# Altium project SVPXGR740_3U.PrjPcb (part 3 of 8)

## Sheet GR740_Memory.SchDoc
size A3
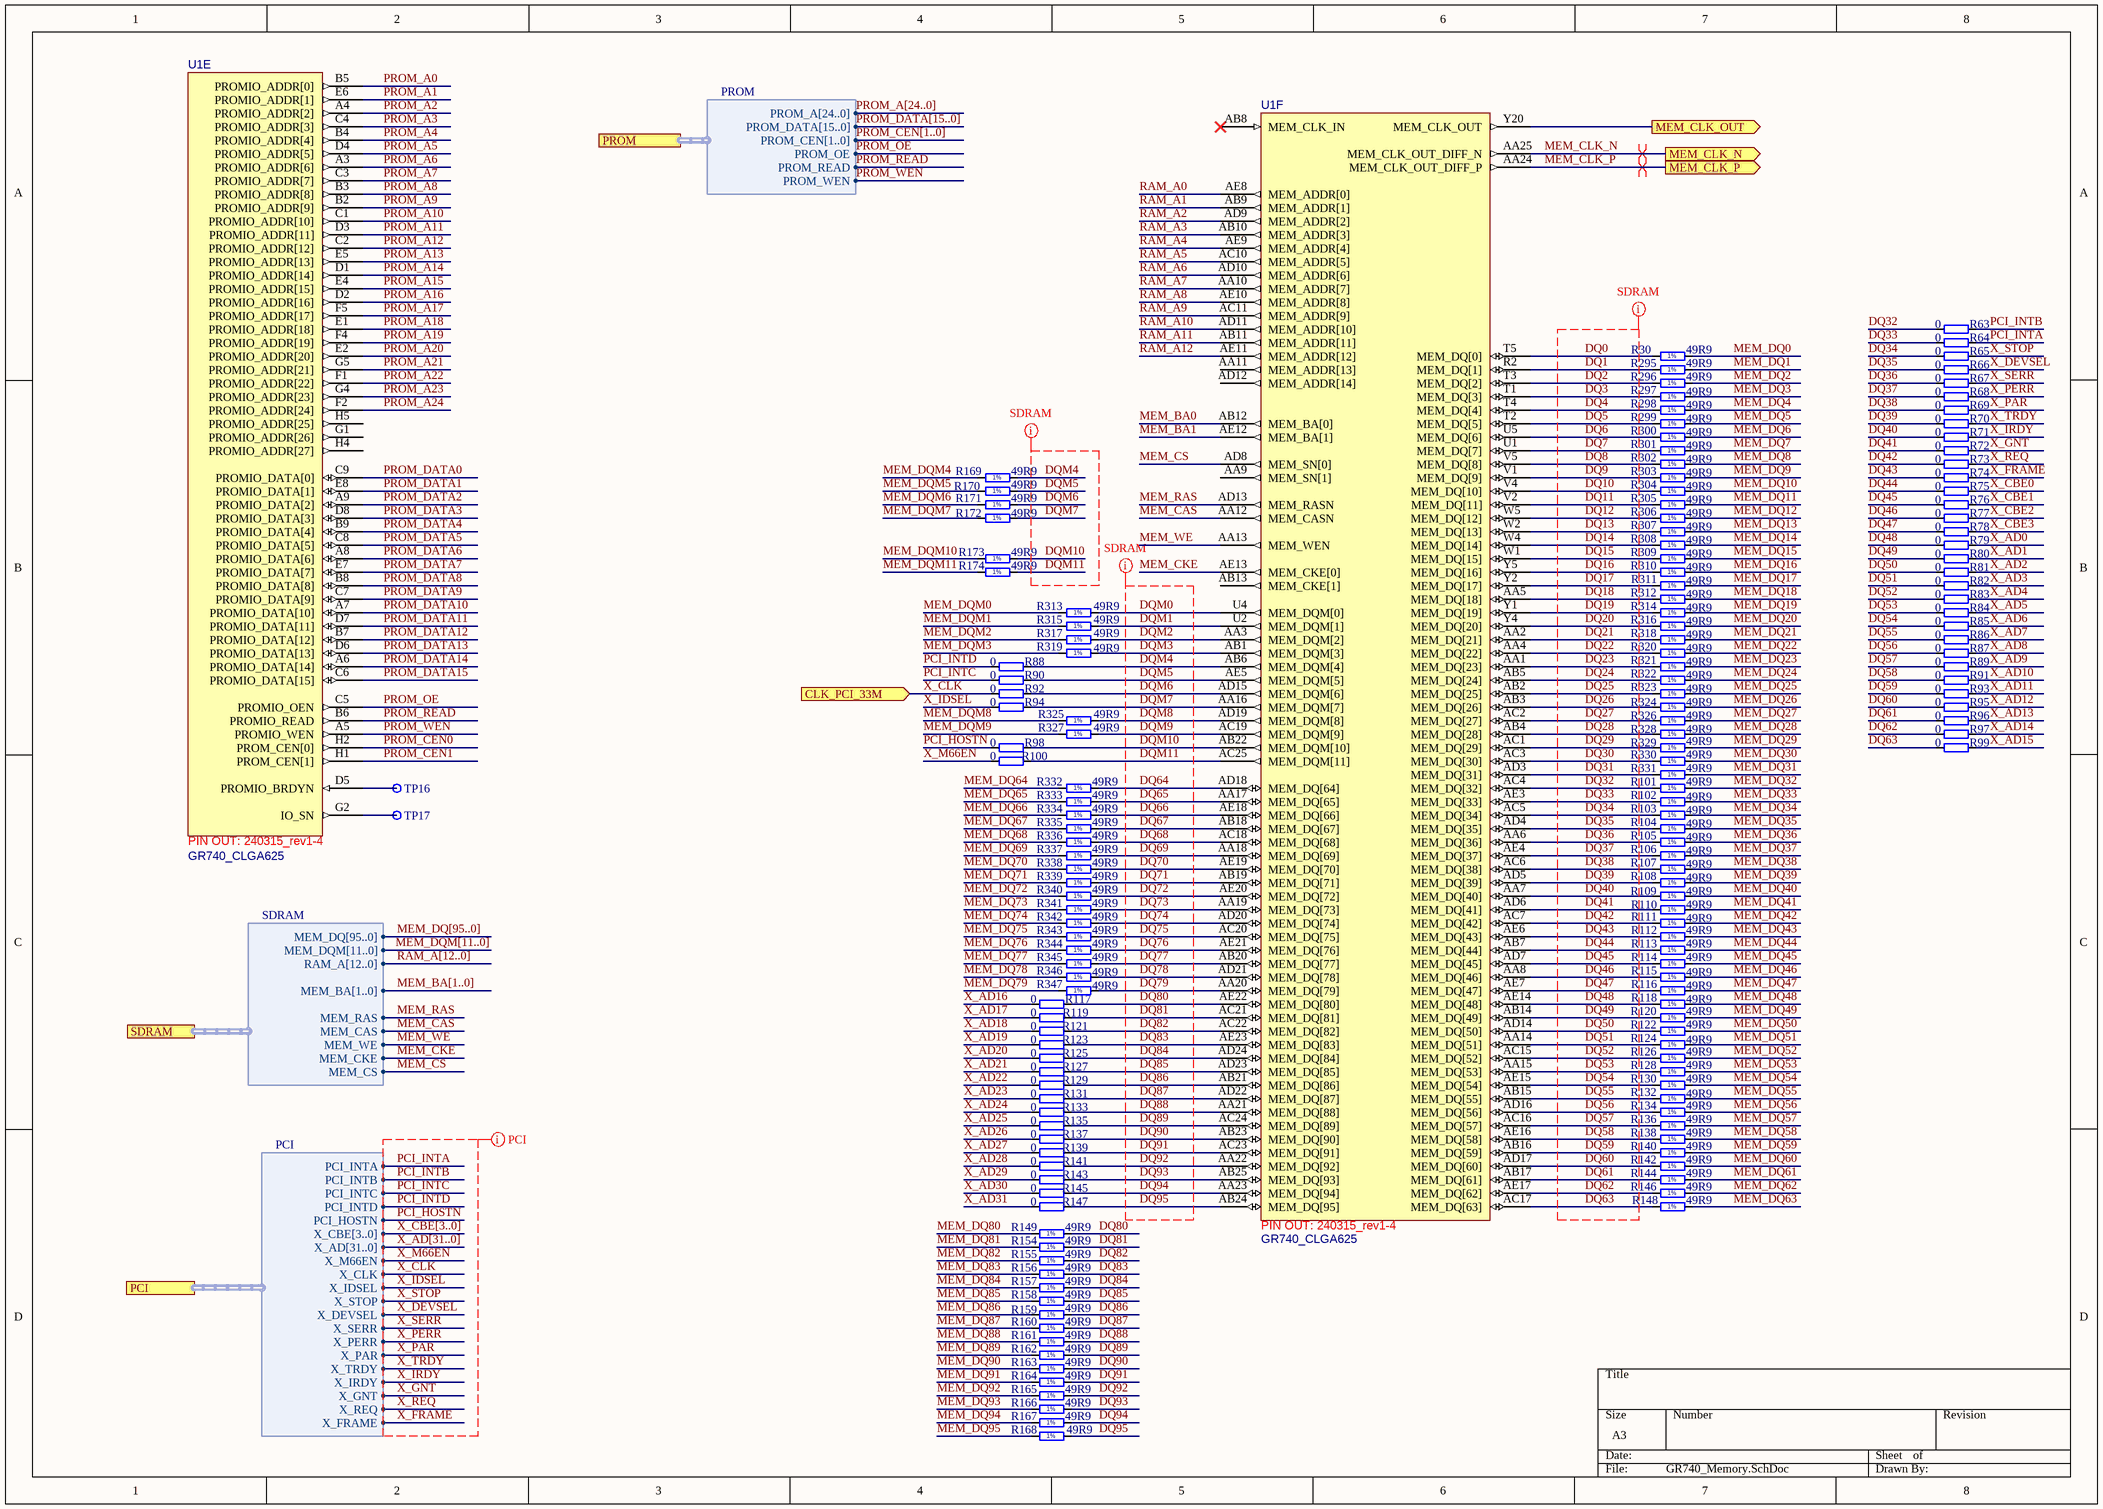
[diagram p8: GR740_Memory.SchDoc]

### Parts
R30  49R9  [RESC0603X28N]
R63  0  [RESC0603X28N]
R64  0  [RESC0603X28N]
R65  0  [RESC0603X28N]
R66  0  [RESC0603X28N]
R67  0  [RESC0603X28N]
R68  0  [RESC0603X28N]
R69  0  [RESC0603X28N]
R70  0  [RESC0603X28N]
R71  0  [RESC0603X28N]
R72  0  [RESC0603X28N]
R73  0  [RESC0603X28N]
R74  0  [RESC0603X28N]
R75  0  [RESC0603X28N]
R76  0  [RESC0603X28N]
R77  0  [RESC0603X28N]
R78  0  [RESC0603X28N]
R79  0  [RESC0603X28N]
R80  0  [RESC0603X28N]
R81  0  [RESC0603X28N]
R82  0  [RESC0603X28N]
R83  0  [RESC0603X28N]
R84  0  [RESC0603X28N]
R85  0  [RESC0603X28N]
R86  0  [RESC0603X28N]
R87  0  [RESC0603X28N]
R88  0  [RESC0603X28N]
R89  0  [RESC0603X28N]
R90  0  [RESC0603X28N]
R91  0  [RESC0603X28N]
R92  0  [RESC0603X28N]
R93  0  [RESC0603X28N]
R94  0  [RESC0603X28N]
R95  0  [RESC0603X28N]
R96  0  [RESC0603X28N]
R97  0  [RESC0603X28N]
R98  0  [RESC0603X28N]
R99  0  [RESC0603X28N]
R100  0  [RESC0603X28N]
R101  49R9  [RESC0603X28N]
R102  49R9  [RESC0603X28N]
R103  49R9  [RESC0603X28N]
R104  49R9  [RESC0603X28N]
R105  49R9  [RESC0603X28N]
R106  49R9  [RESC0603X28N]
R107  49R9  [RESC0603X28N]
R108  49R9  [RESC0603X28N]
R109  49R9  [RESC0603X28N]
R110  49R9  [RESC0603X28N]
R111  49R9  [RESC0603X28N]
R112  49R9  [RESC0603X28N]
R113  49R9  [RESC0603X28N]
R114  49R9  [RESC0603X28N]
R115  49R9  [RESC0603X28N]
R116  49R9  [RESC0603X28N]
R117  0  [RESC0603X28N]
R118  49R9  [RESC0603X28N]
R119  0  [RESC0603X28N]
R120  49R9  [RESC0603X28N]
R121  0  [RESC0603X28N]
R122  49R9  [RESC0603X28N]
R123  0  [RESC0603X28N]
R124  49R9  [RESC0603X28N]
R125  0  [RESC0603X28N]
R126  49R9  [RESC0603X28N]
R127  0  [RESC0603X28N]
R128  49R9  [RESC0603X28N]
R129  0  [RESC0603X28N]
R130  49R9  [RESC0603X28N]
R131  0  [RESC0603X28N]
R132  49R9  [RESC0603X28N]
R133  0  [RESC0603X28N]
R134  49R9  [RESC0603X28N]
R135  0  [RESC0603X28N]
R136  49R9  [RESC0603X28N]
R137  0  [RESC0603X28N]
R138  49R9  [RESC0603X28N]
R139  0  [RESC0603X28N]
R140  49R9  [RESC0603X28N]
R141  0  [RESC0603X28N]
R142  49R9  [RESC0603X28N]
R143  0  [RESC0603X28N]
R144  49R9  [RESC0603X28N]
R145  0  [RESC0603X28N]
R146  49R9  [RESC0603X28N]
R147  0  [RESC0603X28N]
R148  49R9  [RESC0603X28N]
R149  49R9  [RESC0603X28N]
R154  49R9  [RESC0603X28N]
R155  49R9  [RESC0603X28N]
R156  49R9  [RESC0603X28N]
R157  49R9  [RESC0603X28N]
R158  49R9  [RESC0603X28N]
R159  49R9  [RESC0603X28N]
R160  49R9  [RESC0603X28N]
R161  49R9  [RESC0603X28N]
R162  49R9  [RESC0603X28N]
R163  49R9  [RESC0603X28N]
R164  49R9  [RESC0603X28N]
R165  49R9  [RESC0603X28N]
R166  49R9  [RESC0603X28N]
R167  49R9  [RESC0603X28N]
R168  49R9  [RESC0603X28N]
R169  49R9  [RESC0603X28N]
R170  49R9  [RESC0603X28N]
R171  49R9  [RESC0603X28N]
R172  49R9  [RESC0603X28N]
R173  49R9  [RESC0603X28N]
R174  49R9  [RESC0603X28N]
R295  49R9  [RESC0603X28N]
R296  49R9  [RESC0603X28N]
R297  49R9  [RESC0603X28N]
R298  49R9  [RESC0603X28N]
R299  49R9  [RESC0603X28N]
R300  49R9  [RESC0603X28N]
R301  49R9  [RESC0603X28N]
R302  49R9  [RESC0603X28N]
R303  49R9  [RESC0603X28N]
R304  49R9  [RESC0603X28N]
R305  49R9  [RESC0603X28N]
R306  49R9  [RESC0603X28N]
R307  49R9  [RESC0603X28N]
R308  49R9  [RESC0603X28N]
R309  49R9  [RESC0603X28N]
R310  49R9  [RESC0603X28N]
R311  49R9  [RESC0603X28N]
R312  49R9  [RESC0603X28N]
R313  49R9  [RESC0603X28N]
R314  49R9  [RESC0603X28N]
R315  49R9  [RESC0603X28N]
R316  49R9  [RESC0603X28N]
R317  49R9  [RESC0603X28N]
R318  49R9  [RESC0603X28N]
R319  49R9  [RESC0603X28N]
R320  49R9  [RESC0603X28N]
R321  49R9  [RESC0603X28N]
R322  49R9  [RESC0603X28N]
R323  49R9  [RESC0603X28N]
R324  49R9  [RESC0603X28N]
R325  49R9  [RESC0603X28N]
R326  49R9  [RESC0603X28N]
R327  49R9  [RESC0603X28N]
R328  49R9  [RESC0603X28N]
R329  49R9  [RESC0603X28N]
R330  49R9  [RESC0603X28N]
R331  49R9  [RESC0603X28N]
R332  49R9  [RESC0603X28N]
R333  49R9  [RESC0603X28N]
R334  49R9  [RESC0603X28N]
R335  49R9  [RESC0603X28N]
R336  49R9  [RESC0603X28N]
R337  49R9  [RESC0603X28N]
R338  49R9  [RESC0603X28N]
R339  49R9  [RESC0603X28N]
R340  49R9  [RESC0603X28N]
R341  49R9  [RESC0603X28N]
R342  49R9  [RESC0603X28N]
R343  49R9  [RESC0603X28N]
R344  49R9  [RESC0603X28N]
R345  49R9  [RESC0603X28N]
R346  49R9  [RESC0603X28N]
R347  49R9  [RESC0603X28N]
TP16  Test Point  [TPS127]  (value not drawn)
TP17  Test Point  [TPS127]  (value not drawn)
U1  GR740_CLGA625  [BGA625C100P25X25_3182X3182X1543]  (parts E,F of 10)

### Ports
CLK_PCI_33M (in), MEM_CLK_N (out), MEM_CLK_OUT (out), MEM_CLK_P (out), PCI (harness PCI), PROM (harness PROM), SDRAM (harness SDRAM)

### Harnesses
SDRAM: MEM_DQ[95..0], MEM_DQM[11..0], RAM_A[12..0], MEM_BA[1..0], MEM_RAS, MEM_CAS, MEM_WE, MEM_CKE, MEM_CS
PCI: PCI_INTA, PCI_INTB, PCI_INTC, PCI_INTD, PCI_HOSTN, X_CBE[3..0], X_AD[31..0], X_M66EN, X_CLK, X_IDSEL, X_STOP, X_DEVSEL, X_SERR, X_PERR, X_PAR, X_TRDY, X_IRDY, X_GNT, X_REQ, X_FRAME
PROM: PROM_A[24..0], PROM_DATA[15..0], PROM_CEN[1..0], PROM_OE, PROM_READ, PROM_WEN

### Nets
DQ0: R30.1 U1.T5(MEM_DQ[0])
DQ1: R295.1 U1.R2(MEM_DQ[1])
DQ2: R296.1 U1.T3(MEM_DQ[2])
DQ3: R297.1 U1.T1(MEM_DQ[3])
DQ4: R298.1 U1.T4(MEM_DQ[4])
DQ5: R299.1 U1.T2(MEM_DQ[5])
DQ6: R300.1 U1.U5(MEM_DQ[6])
DQ7: R301.1 U1.U1(MEM_DQ[7])
DQ8: R302.1 U1.V5(MEM_DQ[8])
DQ9: R303.1 U1.V1(MEM_DQ[9])
DQ10: R304.1 U1.V4(MEM_DQ[10])
DQ11: R305.1 U1.V2(MEM_DQ[11])
DQ12: R306.1 U1.W5(MEM_DQ[12])
DQ13: R307.1 U1.W2(MEM_DQ[13])
DQ14: R308.1 U1.W4(MEM_DQ[14])
DQ15: R309.1 U1.W1(MEM_DQ[15])
DQ16: R310.1 U1.Y5(MEM_DQ[16])
DQ17: R311.1 U1.Y2(MEM_DQ[17])
DQ18: R312.1 U1.AA5(MEM_DQ[18])
DQ19: R314.1 U1.Y1(MEM_DQ[19])
DQ20: R316.1 U1.Y4(MEM_DQ[20])
DQ21: R318.1 U1.AA2(MEM_DQ[21])
DQ22: R320.1 U1.AA4(MEM_DQ[22])
DQ23: R321.1 U1.AA1(MEM_DQ[23])
DQ24: R322.1 U1.AB5(MEM_DQ[24])
DQ25: R323.1 U1.AB2(MEM_DQ[25])
DQ26: R324.1 U1.AB3(MEM_DQ[26])
DQ27: R326.1 U1.AC2(MEM_DQ[27])
DQ28: R328.1 U1.AB4(MEM_DQ[28])
DQ29: R329.1 U1.AC1(MEM_DQ[29])
DQ30: R330.1 U1.AC3(MEM_DQ[30])
DQ31: R331.1 U1.AD3(MEM_DQ[31])
DQ32: R63.1 R101.1 U1.AC4(MEM_DQ[32])
DQ33: R64.1 R102.1 U1.AE3(MEM_DQ[33])
DQ34: R65.1 R103.1 U1.AC5(MEM_DQ[34])
DQ35: R66.1 R104.1 U1.AD4(MEM_DQ[35])
DQ36: R67.1 R105.1 U1.AA6(MEM_DQ[36])
DQ37: R68.1 R106.1 U1.AE4(MEM_DQ[37])
DQ38: R69.1 R107.1 U1.AC6(MEM_DQ[38])
DQ39: R70.1 R108.1 U1.AD5(MEM_DQ[39])
DQ40: R71.1 R109.1 U1.AA7(MEM_DQ[40])
DQ41: R72.1 R110.1 U1.AD6(MEM_DQ[41])
DQ42: R73.1 R111.1 U1.AC7(MEM_DQ[42])
DQ43: R74.1 R112.1 U1.AE6(MEM_DQ[43])
DQ44: R75.1 R113.1 U1.AB7(MEM_DQ[44])
DQ45: R76.1 R114.1 U1.AD7(MEM_DQ[45])
DQ46: R77.1 R115.1 U1.AA8(MEM_DQ[46])
DQ47: R78.1 R116.1 U1.AE7(MEM_DQ[47])
DQ48: R79.1 R118.1 U1.AE14(MEM_DQ[48])
DQ49: R80.1 R120.1 U1.AB14(MEM_DQ[49])
DQ50: R81.1 R122.1 U1.AD14(MEM_DQ[50])
DQ51: R82.1 R124.1 U1.AA14(MEM_DQ[51])
DQ52: R83.1 R126.1 U1.AC15(MEM_DQ[52])
DQ53: R84.1 R128.1 U1.AA15(MEM_DQ[53])
DQ54: R85.1 R130.1 U1.AE15(MEM_DQ[54])
DQ55: R86.1 R132.1 U1.AB15(MEM_DQ[55])
DQ56: R87.1 R134.1 U1.AD16(MEM_DQ[56])
DQ57: R89.1 R136.1 U1.AC16(MEM_DQ[57])
DQ58: R91.1 R138.1 U1.AE16(MEM_DQ[58])
DQ59: R93.1 R140.1 U1.AB16(MEM_DQ[59])
DQ60: R95.1 R142.1 U1.AD17(MEM_DQ[60])
DQ61: R96.1 R144.1 U1.AB17(MEM_DQ[61])
DQ62: R97.1 R146.1 U1.AE17(MEM_DQ[62])
DQ63: R99.1 R148.1 U1.AC17(MEM_DQ[63])
DQ64: R332.2 U1.AD18(MEM_DQ[64])
DQ65: R333.2 U1.AA17(MEM_DQ[65])
DQ66: R334.2 U1.AE18(MEM_DQ[66])
DQ67: R335.2 U1.AB18(MEM_DQ[67])
DQ68: R336.2 U1.AC18(MEM_DQ[68])
DQ69: R337.2 U1.AA18(MEM_DQ[69])
DQ70: R338.2 U1.AE19(MEM_DQ[70])
DQ71: R339.2 U1.AB19(MEM_DQ[71])
DQ72: R340.2 U1.AE20(MEM_DQ[72])
DQ73: R341.2 U1.AA19(MEM_DQ[73])
DQ74: R342.2 U1.AD20(MEM_DQ[74])
DQ75: R343.2 U1.AC20(MEM_DQ[75])
DQ76: R344.2 U1.AE21(MEM_DQ[76])
DQ77: R345.2 U1.AB20(MEM_DQ[77])
DQ78: R346.2 U1.AD21(MEM_DQ[78])
DQ79: R347.2 U1.AA20(MEM_DQ[79])
DQ80: R117.2 R149.2 U1.AE22(MEM_DQ[80])
DQ81: R119.2 R154.2 U1.AC21(MEM_DQ[81])
DQ82: R121.2 R155.2 U1.AC22(MEM_DQ[82])
DQ83: R123.2 R156.2 U1.AE23(MEM_DQ[83])
DQ84: R125.2 R157.2 U1.AD24(MEM_DQ[84])
DQ85: R127.2 R158.2 U1.AD23(MEM_DQ[85])
DQ86: R129.2 R159.2 U1.AB21(MEM_DQ[86])
DQ87: R131.2 R160.2 U1.AD22(MEM_DQ[87])
DQ88: R133.2 R161.2 U1.AA21(MEM_DQ[88])
DQ89: R135.2 R162.2 U1.AC24(MEM_DQ[89])
DQ90: R137.2 R163.2 U1.AB23(MEM_DQ[90])
DQ91: R139.2 R164.2 U1.AC23(MEM_DQ[91])
DQ92: R141.2 R165.2 U1.AA22(MEM_DQ[92])
DQ93: R143.2 R166.2 U1.AB25(MEM_DQ[93])
DQ94: R145.2 R167.2 U1.AA23(MEM_DQ[94])
DQ95: R147.2 R168.2 U1.AB24(MEM_DQ[95])
DQM0: R313.2 U1.U4(MEM_DQM[0])
DQM1: R315.2 U1.U2(MEM_DQM[1])
DQM2: R317.2 U1.AA3(MEM_DQM[2])
DQM3: R319.2 U1.AB1(MEM_DQM[3])
DQM4: R88.2 R169.2 U1.AB6(MEM_DQM[4])
DQM5: R90.2 R170.2 U1.AE5(MEM_DQM[5])
DQM6: R92.2 R171.2 U1.AD15(MEM_DQM[6])
DQM7: R94.2 R172.2 U1.AA16(MEM_DQM[7])
DQM8: R325.2 U1.AD19(MEM_DQM[8])
DQM9: R327.2 U1.AC19(MEM_DQM[9])
DQM10: R98.2 R173.2 U1.AB22(MEM_DQM[10])
DQM11: R100.2 R174.2 U1.AC25(MEM_DQM[11])
MEM_BA0: U1.AB12(MEM_BA[0])
MEM_BA1: U1.AE12(MEM_BA[1])
MEM_CAS: U1.AA12(MEM_CASN) ; port SDRAM.MEM_CAS
MEM_CKE: U1.AE13(MEM_CKE[0]) ; port SDRAM.MEM_CKE
MEM_CLK_N: U1.AA25(MEM_CLK_OUT_DIFF_N) ; port MEM_CLK_N
MEM_CLK_OUT: U1.Y20(MEM_CLK_OUT) ; port MEM_CLK_OUT
MEM_CLK_P: U1.AA24(MEM_CLK_OUT_DIFF_P) ; port MEM_CLK_P
MEM_CS: U1.AD8(MEM_SN[0]) ; port SDRAM.MEM_CS
MEM_DQ0: R30.2
MEM_DQ1: R295.2
MEM_DQ2: R296.2
MEM_DQ3: R297.2
MEM_DQ4: R298.2
MEM_DQ5: R299.2
MEM_DQ6: R300.2
MEM_DQ7: R301.2
MEM_DQ8: R302.2
MEM_DQ9: R303.2
MEM_DQ10: R304.2
MEM_DQ11: R305.2
MEM_DQ12: R306.2
MEM_DQ13: R307.2
MEM_DQ14: R308.2
MEM_DQ15: R309.2
MEM_DQ16: R310.2
MEM_DQ17: R311.2
MEM_DQ18: R312.2
MEM_DQ19: R314.2
MEM_DQ20: R316.2
MEM_DQ21: R318.2
MEM_DQ22: R320.2
MEM_DQ23: R321.2
MEM_DQ24: R322.2
MEM_DQ25: R323.2
MEM_DQ26: R324.2
MEM_DQ27: R326.2
MEM_DQ28: R328.2
MEM_DQ29: R329.2
MEM_DQ30: R330.2
MEM_DQ31: R331.2
MEM_DQ32: R101.2
MEM_DQ33: R102.2
MEM_DQ34: R103.2
MEM_DQ35: R104.2
MEM_DQ36: R105.2
MEM_DQ37: R106.2
MEM_DQ38: R107.2
MEM_DQ39: R108.2
MEM_DQ40: R109.2
MEM_DQ41: R110.2
MEM_DQ42: R111.2
MEM_DQ43: R112.2
MEM_DQ44: R113.2
MEM_DQ45: R114.2
MEM_DQ46: R115.2
MEM_DQ47: R116.2
MEM_DQ48: R118.2
MEM_DQ49: R120.2
MEM_DQ50: R122.2
MEM_DQ51: R124.2
MEM_DQ52: R126.2
MEM_DQ53: R128.2
MEM_DQ54: R130.2
MEM_DQ55: R132.2
MEM_DQ56: R134.2
MEM_DQ57: R136.2
MEM_DQ58: R138.2
MEM_DQ59: R140.2
MEM_DQ60: R142.2
MEM_DQ61: R144.2
MEM_DQ62: R146.2
MEM_DQ63: R148.2
MEM_DQ64: R332.1
MEM_DQ65: R333.1
MEM_DQ66: R334.1
MEM_DQ67: R335.1
MEM_DQ68: R336.1
MEM_DQ69: R337.1
MEM_DQ70: R338.1
MEM_DQ71: R339.1
MEM_DQ72: R340.1
MEM_DQ73: R341.1
MEM_DQ74: R342.1
MEM_DQ75: R343.1
MEM_DQ76: R344.1
MEM_DQ77: R345.1
MEM_DQ78: R346.1
MEM_DQ79: R347.1
MEM_DQ80: R149.1
MEM_DQ81: R154.1
MEM_DQ82: R155.1
MEM_DQ83: R156.1
MEM_DQ84: R157.1
MEM_DQ85: R158.1
MEM_DQ86: R159.1
MEM_DQ87: R160.1
MEM_DQ88: R161.1
MEM_DQ89: R162.1
MEM_DQ90: R163.1
MEM_DQ91: R164.1
MEM_DQ92: R165.1
MEM_DQ93: R166.1
MEM_DQ94: R167.1
MEM_DQ95: R168.1
MEM_DQM0: R313.1
MEM_DQM1: R315.1
MEM_DQM2: R317.1
MEM_DQM3: R319.1
MEM_DQM4: R169.1
MEM_DQM5: R170.1
MEM_DQM6: R171.1
MEM_DQM7: R172.1
MEM_DQM8: R325.1
MEM_DQM9: R327.1
MEM_DQM10: R173.1
MEM_DQM11: R174.1
MEM_RAS: U1.AD13(MEM_RASN) ; port SDRAM.MEM_RAS
MEM_WE: U1.AA13(MEM_WEN) ; port SDRAM.MEM_WE
PCI_HOSTN: R98.1 ; port PCI.PCI_HOSTN
PCI_INTA: R64.2 ; port PCI.PCI_INTA
PCI_INTB: R63.2 ; port PCI.PCI_INTB
PCI_INTC: R90.1 ; port PCI.PCI_INTC
PCI_INTD: R88.1 ; port PCI.PCI_INTD
PROM_A0: U1.B5(PROMIO_ADDR[0])
PROM_A1: U1.E6(PROMIO_ADDR[1])
PROM_A2: U1.A4(PROMIO_ADDR[2])
PROM_A3: U1.C4(PROMIO_ADDR[3])
PROM_A4: U1.B4(PROMIO_ADDR[4])
PROM_A5: U1.D4(PROMIO_ADDR[5])
PROM_A6: U1.A3(PROMIO_ADDR[6])
PROM_A7: U1.C3(PROMIO_ADDR[7])
PROM_A8: U1.B3(PROMIO_ADDR[8])
PROM_A9: U1.B2(PROMIO_ADDR[9])
PROM_A10: U1.C1(PROMIO_ADDR[10])
PROM_A11: U1.D3(PROMIO_ADDR[11])
PROM_A12: U1.C2(PROMIO_ADDR[12])
PROM_A13: U1.E5(PROMIO_ADDR[13])
PROM_A14: U1.D1(PROMIO_ADDR[14])
PROM_A15: U1.E4(PROMIO_ADDR[15])
PROM_A16: U1.D2(PROMIO_ADDR[16])
PROM_A17: U1.F5(PROMIO_ADDR[17])
PROM_A18: U1.E1(PROMIO_ADDR[18])
PROM_A19: U1.F4(PROMIO_ADDR[19])
PROM_A20: U1.E2(PROMIO_ADDR[20])
PROM_A21: U1.G5(PROMIO_ADDR[21])
PROM_A22: U1.F1(PROMIO_ADDR[22])
PROM_A23: U1.G4(PROMIO_ADDR[23])
PROM_A24: U1.F2(PROMIO_ADDR[24])
PROM_CEN0: U1.H2(PROM_CEN[0])
PROM_CEN1: U1.H1(PROM_CEN[1])
PROM_DATA0: U1.C9(PROMIO_DATA[0])
PROM_DATA1: U1.E8(PROMIO_DATA[1])
PROM_DATA2: U1.A9(PROMIO_DATA[2])
PROM_DATA3: U1.D8(PROMIO_DATA[3])
PROM_DATA4: U1.B9(PROMIO_DATA[4])
PROM_DATA5: U1.C8(PROMIO_DATA[5])
PROM_DATA6: U1.A8(PROMIO_DATA[6])
PROM_DATA7: U1.E7(PROMIO_DATA[7])
PROM_DATA8: U1.B8(PROMIO_DATA[8])
PROM_DATA9: U1.C7(PROMIO_DATA[9])
PROM_DATA10: U1.A7(PROMIO_DATA[10])
PROM_DATA11: U1.D7(PROMIO_DATA[11])
PROM_DATA12: U1.B7(PROMIO_DATA[12])
PROM_DATA13: U1.D6(PROMIO_DATA[13])
PROM_DATA14: U1.A6(PROMIO_DATA[14])
PROM_DATA15: U1.C6(PROMIO_DATA[15])
PROM_OE: U1.C5(PROMIO_OEN) ; port PROM.PROM_OE
PROM_READ: U1.B6(PROMIO_READ) ; port PROM.PROM_READ
PROM_WEN: U1.A5(PROMIO_WEN) ; port PROM.PROM_WEN
RAM_A0: U1.AE8(MEM_ADDR[0])
RAM_A1: U1.AB9(MEM_ADDR[1])
RAM_A2: U1.AD9(MEM_ADDR[2])
RAM_A3: U1.AB10(MEM_ADDR[3])
RAM_A4: U1.AE9(MEM_ADDR[4])
RAM_A5: U1.AC10(MEM_ADDR[5])
RAM_A6: U1.AD10(MEM_ADDR[6])
RAM_A7: U1.AA10(MEM_ADDR[7])
RAM_A8: U1.AE10(MEM_ADDR[8])
RAM_A9: U1.AC11(MEM_ADDR[9])
RAM_A10: U1.AD11(MEM_ADDR[10])
RAM_A11: U1.AB11(MEM_ADDR[11])
RAM_A12: U1.AE11(MEM_ADDR[12])
X_AD0: R79.2
X_AD1: R80.2
X_AD2: R81.2
X_AD3: R82.2
X_AD4: R83.2
X_AD5: R84.2
X_AD6: R85.2
X_AD7: R86.2
X_AD8: R87.2
X_AD9: R89.2
X_AD10: R91.2
X_AD11: R93.2
X_AD12: R95.2
X_AD13: R96.2
X_AD14: R97.2
X_AD15: R99.2
X_AD16: R117.1
X_AD17: R119.1
X_AD18: R121.1
X_AD19: R123.1
X_AD20: R125.1
X_AD21: R127.1
X_AD22: R129.1
X_AD23: R131.1
X_AD24: R133.1
X_AD25: R135.1
X_AD26: R137.1
X_AD27: R139.1
X_AD28: R141.1
X_AD29: R143.1
X_AD30: R145.1
X_AD31: R147.1
X_CBE0: R75.2
X_CBE1: R76.2
X_CBE2: R77.2
X_CBE3: R78.2
X_CLK: R92.1 ; port CLK_PCI_33M, port PCI.X_CLK
X_DEVSEL: R66.2 ; port PCI.X_DEVSEL
X_FRAME: R74.2 ; port PCI.X_FRAME
X_GNT: R72.2 ; port PCI.X_GNT
X_IDSEL: R94.1 ; port PCI.X_IDSEL
X_IRDY: R71.2 ; port PCI.X_IRDY
X_M66EN: R100.1 ; port PCI.X_M66EN
X_PAR: R69.2 ; port PCI.X_PAR
X_PERR: R68.2 ; port PCI.X_PERR
X_REQ: R73.2 ; port PCI.X_REQ
X_SERR: R67.2 ; port PCI.X_SERR
X_STOP: R65.2 ; port PCI.X_STOP
X_TRDY: R70.2 ; port PCI.X_TRDY
NetTP16_1: TP16.1 U1.D5(PROMIO_BRDYN)
NetTP17_1: TP17.1 U1.G2(IO_SN)

Not connected (* = marked no-connect by the designer): U1 AA9(MEM_SN[1]) AA11(MEM_ADDR[13]) AB8(MEM_CLK_IN)* AB13(MEM_CKE[1]) AD12(MEM_ADDR[14]) G1(PROMIO_ADDR[26]) H4(PROMIO_ADDR[27]) H5(PROMIO_ADDR[25])

### Buses and harness runs
bus MEM_BA[1..0]
bus MEM_DQ[95..0]
bus MEM_DQM[11..0]
bus PROM_A[24..0]
bus PROM_CEN[1..0]
bus PROM_DATA[15..0]
bus RAM_A[12..0]
bus X_AD[31..0]
bus X_CBE[3..0]

### Layout directives
rule Width Constraint [Pref Impedance = 50.00ohms    Min Impedance = 50.00ohms    Max Impedance = 50.00ohms]; net class SDRAM: DQ0, DQ1, DQ2, DQ3, DQ4, DQ5, DQ6, DQ7, DQ8, DQ9, DQ10, DQ11, DQ12, DQ13, DQ14, DQ15, DQ16, DQ17, DQ18, DQ19, DQ20, DQ21, DQ22, DQ23, DQ24, DQ25, DQ26, DQ27, DQ28, DQ29, DQ30, DQ31, DQ32, DQ33, DQ34, DQ35, DQ36, DQ37, DQ38, DQ39, DQ40, DQ41, DQ42, DQ43, DQ44, DQ45, DQ46, DQ47, DQ48, DQ49, DQ50, DQ51, DQ52, DQ53, DQ54, DQ55, DQ56, DQ57, DQ58, DQ59, DQ60, DQ61, DQ62, DQ63, DQ64, DQ65, DQ66, DQ67, DQ68, DQ69, DQ70, DQ71, DQ72, DQ73, DQ74, DQ75, DQ76, DQ77, DQ78, DQ79, DQ80, DQ81, DQ82, DQ83, DQ84, DQ85, DQ86, DQ87, DQ88, DQ89, DQ90, DQ91, DQ92, DQ93, DQ94, DQ95, DQM0, DQM1, DQM2, DQM3, DQM4, DQM5, DQM6, DQM7, DQM8, DQM9, DQM10, DQM11
rule Width Constraint [Pref Impedance = 50.00ohms    Min Impedance = 50.00ohms    Max Impedance = 50.00ohms]; net class PCI: PCI_HOSTN, PCI_INTA, PCI_INTB, PCI_INTC, PCI_INTD, X_AD[31..0], X_CBE[3..0], X_CLK, X_DEVSEL, X_FRAME, X_GNT, X_IDSEL, X_IRDY, X_M66EN, X_PAR, X_PERR, X_REQ, X_SERR, X_STOP, X_TRDY
differential pair: MEM_CLK_N, MEM_CLK_P

### Notes on the sheet
- (in symbol GR740_CLGA625, part E) PIN OUT: 240315_rev1-4
- (in symbol GR740_CLGA625, part F) PIN OUT: 240315_rev1-4
- (in symbol R0201_49R9_1%_0.05W_200PPM) 1%

### Library data of the parts
R30 R101-R116 R118 R120 R122 R124 R126 R128 R130 R132 R134 R136 R138 R140 R142 R144 R146 R148 R149 R154-R174 R295-R347 = R0201_49R9_1%_0.05W_200PPM: Resistor - 1%; Part Description: Thick Film Chip Resistor; Manufacturer: GENERIC; Manufacturer1 Part Number: CRCW020149R9FNED; PressFit: No; Power: 0.05W; TC: ±200ppm/°C; Part Number: R0201_49R9_1%_0.05W_200PPM; Component Kind: Standard; Component Type: Standard; Pin Count: 2; Value: 49R9; Status: Not Recommended; Manufacturer Part Number: R0201_49R9_1%_0.05W_200PPM; Case: 0201; Mounted: Yes; Sense: No; Socket: No; SMD: Yes; Manufacturer1 Example: VISHAY; Manufacturer1 ComponentHeight: 0.27mm; HelpURL: \\cern.ch\dfs\Applications\Altium\Datasheets\R0201_VISHAY_CRCW e3.pdf; Author: CERN DEM BC; CreateDate: 10.01.2020; LatestRevisionDate: 10.01.2020; Tolerance: ±1%
R63-R100 R117 R119 R121 R123 R125 R127 R129 R131 R133 R135 R137 R139 R141 R143 R145 R147 = R0201_0R_JUMPER: Resistor; Part Description: 1A (0.05R Max DC Resistance) Zero Ohm Jumper; Manufacturer: GENERIC; Manufacturer1 Part Number: CRCW02010000Z0ED; PressFit: No; Part Number: R0201_0R_JUMPER; Component Kind: Standard; Component Type: Standard; Pin Count: 2; Value: 0; Status: Not Recommended; Manufacturer Part Number: R0201_0R_JUMPER; Case: 0201; Mounted: Yes; Sense: No; Socket: No; SMD: Yes; Manufacturer1 Example: VISHAY; Manufacturer1 ComponentHeight: 0.27mm; HelpURL: \\cern.ch\dfs\Applications\Altium\Datasheets\R0201_VISHAY_CRCW e3.pdf; Author: CERN DEM JLC; CreateDate: 19.11.2014; LatestRevisionDate: 08.01.2015
TP16 TP17 = SMD_PAD_1.27X1.27MM: Part Description: 1.27mm x 1.27mm PCB Copper Area (SMD Test Point); Mounted: No; Part Number: SMD_PAD_1.27X1.27MM; Component Kind: Standard (No BOM); Component Type: Standard (No BOM); Pin Count: 1; Family: Test Point; Socket: No; SMD: No; Sense: No; Status: None; ComponentHeight: 0mm; HelpURL: Undefined; Author: CERN DEM JLC; CreateDate: 12.01.2008; LatestRevisionDate: 12.01.2008; PackageDescription: 1.27mm x 1.27mm PCB Copper Area (SMD Test Point)
U1 = GR740_CLGA625: Category: IC; Technology: SMD

## Sheet GR740_Power.SchDoc
size A3
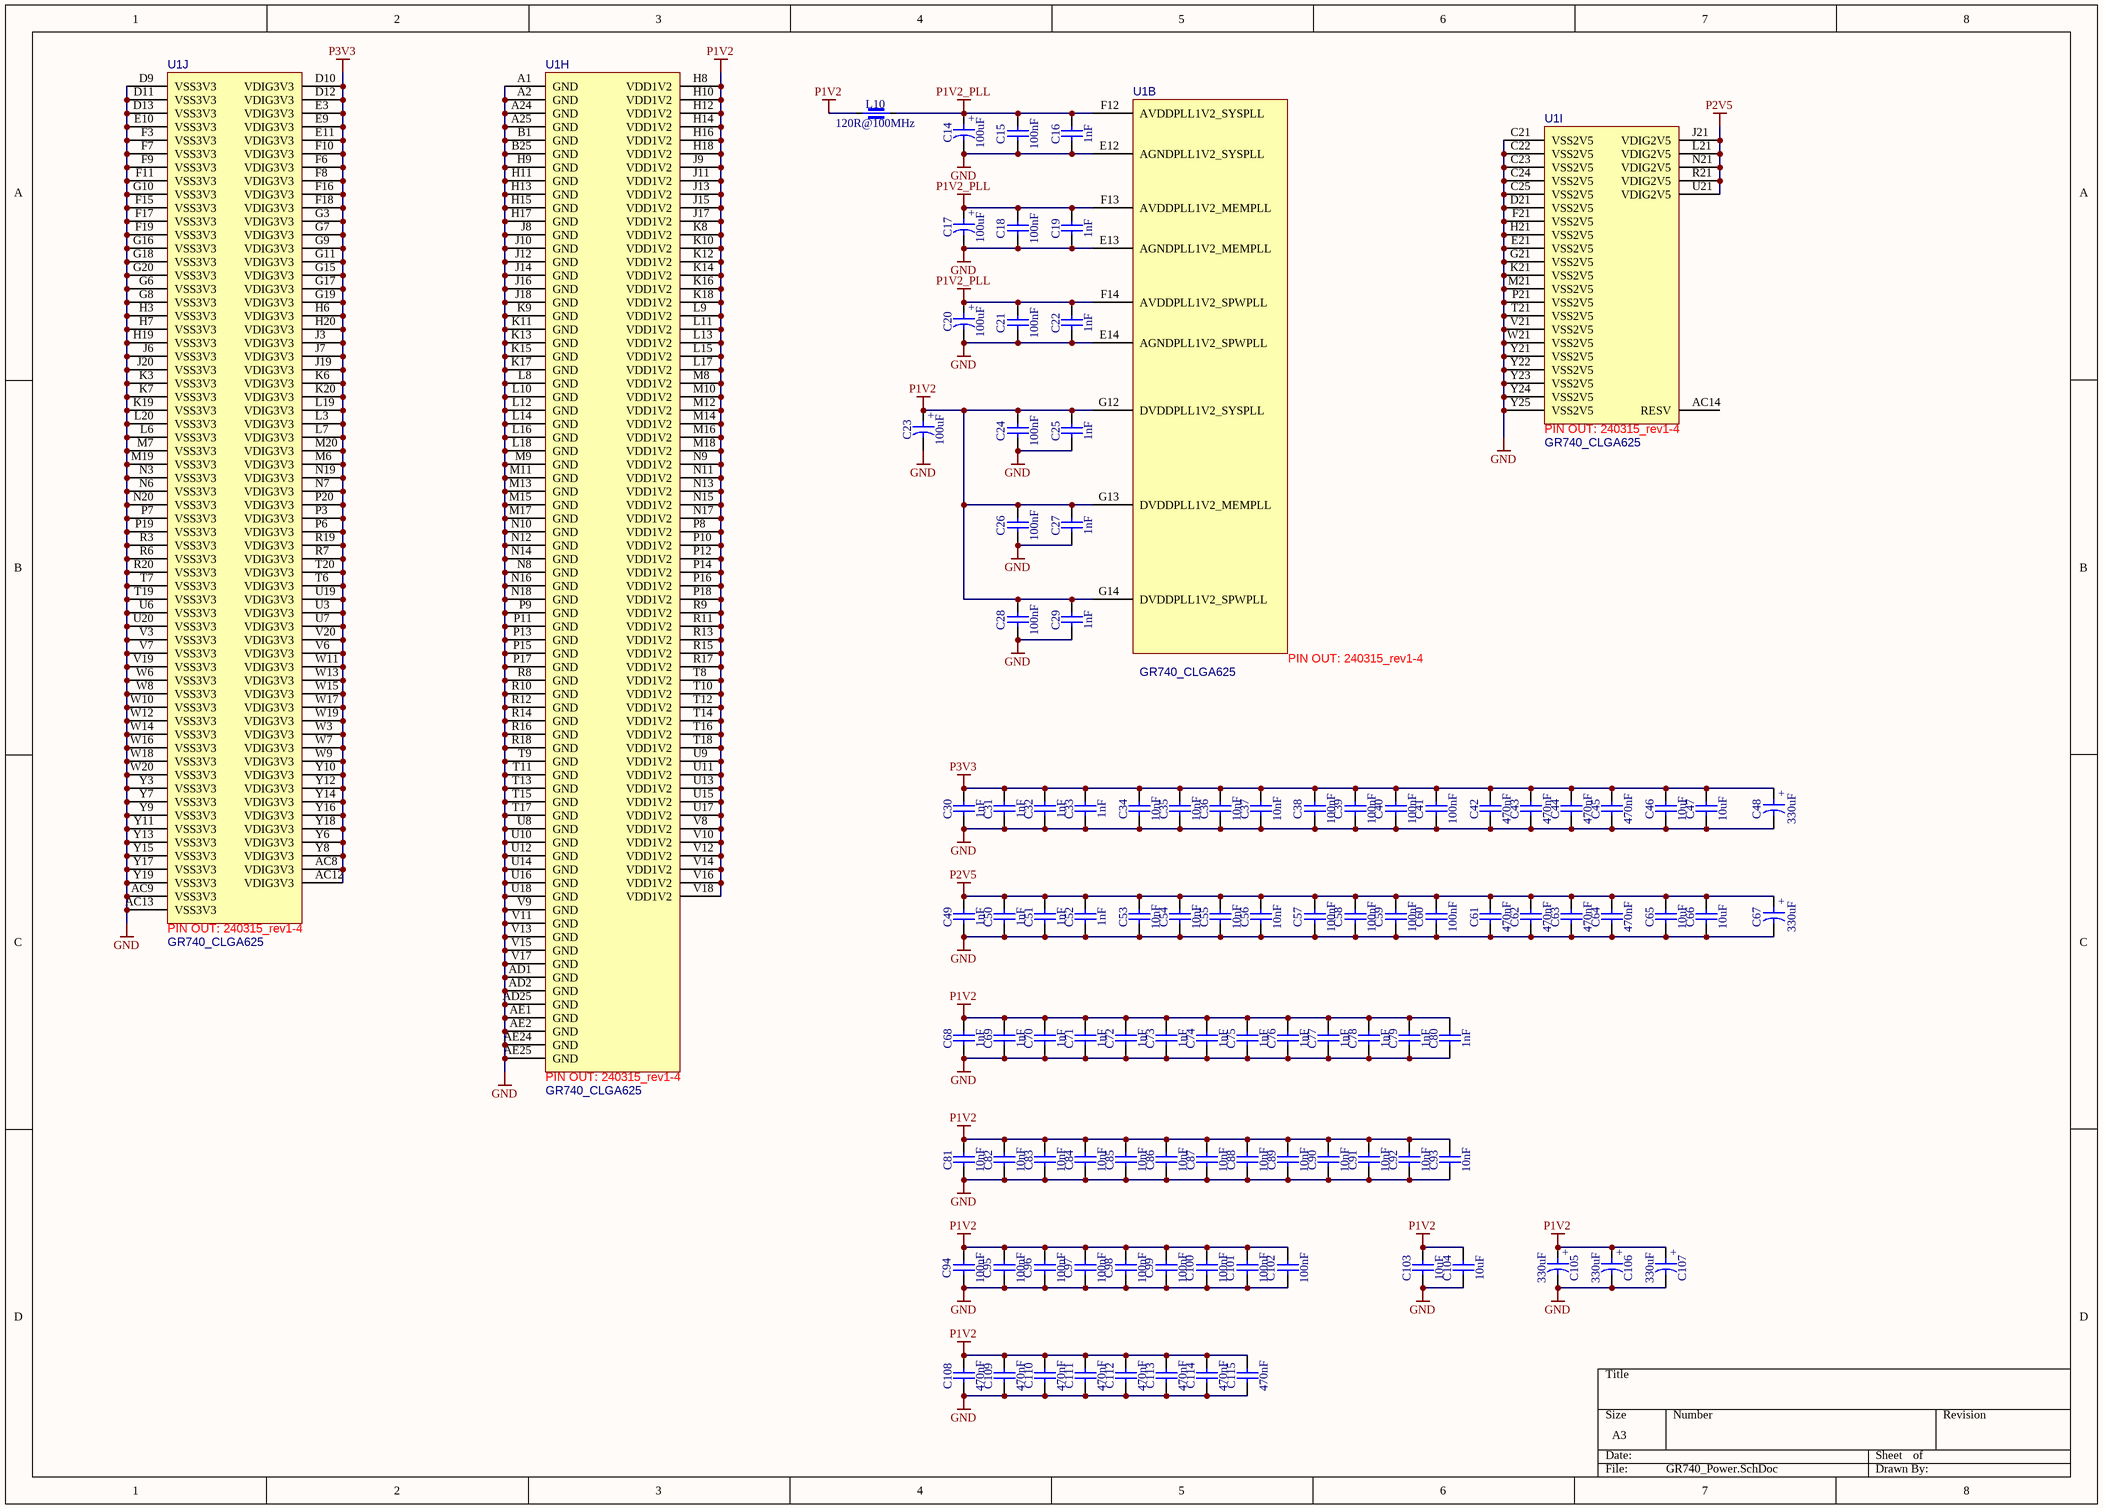
[diagram p9: GR740_Power.SchDoc]

### Parts
(Parts that share a designator on the sheet are numbered #1, #2 ... from top to bottom, then left to right.)
C14  100uF  [CAPMP3528X210N]
C15  100nF  [CAPC0603X33N]
C16  1nF  [CAPC0603X33N]
C17  100uF  [CAPMP3528X210N]
C18  100nF  [CAPC0603X33N]
C19  1nF  [CAPC0603X33N]
C20  100uF  [CAPMP3528X210N]
C21  100nF  [CAPC0603X33N]
C22  1nF  [CAPC0603X33N]
C23  100uF  [CAPMP3528X210N]
C24  100nF  [CAPC0603X33N]
C25  1nF  [CAPC0603X33N]
C26  100nF  [CAPC0603X33N]
C27  1nF  [CAPC0603X33N]
C28  100nF  [CAPC0603X33N]
C29  1nF  [CAPC0603X33N]
C30  1nF  [CAPC0603X33N]
C31  1nF  [CAPC0603X33N]
C32  1nF  [CAPC0603X33N]
C33  1nF  [CAPC0603X33N]
C34  10nF  [CAPC0603X33N]
C35  10nF  [CAPC0603X33N]
C36  10nF  [CAPC0603X33N]
C37  10nF  [CAPC0603X33N]
C38  100nF  [CAPC0603X33N]
C39  100nF  [CAPC0603X33N]
C40  100nF  [CAPC0603X33N]
C41#1  100nF  [CAPC0603X33N]
C42  470nF  [CAPC0603X33N]
C43  470nF  [CAPC0603X33N]
C44  470nF  [CAPC0603X33N]
C45  470nF  [CAPC0603X33N]
C46  10uF  [CAPC2012X135N]
C47  10uF  [CAPC2012X135N]
C48  330uF  [CAPMP7343X310N]
C49  1nF  [CAPC0603X33N]
C50  1nF  [CAPC0603X33N]
C51  1nF  [CAPC0603X33N]
C52  1nF  [CAPC0603X33N]
C53  10nF  [CAPC0603X33N]
C54  10nF  [CAPC0603X33N]
C55  10nF  [CAPC0603X33N]
C56  10nF  [CAPC0603X33N]
C57  100nF  [CAPC0603X33N]
C58  100nF  [CAPC0603X33N]
C59  100nF  [CAPC0603X33N]
C60  100nF  [CAPC0603X33N]
C61  470nF  [CAPC0603X33N]
C62  470nF  [CAPC0603X33N]
C63  470nF  [CAPC0603X33N]
C64  470nF  [CAPC0603X33N]
C65  10uF  [CAPC2012X135N]
C66  10uF  [CAPC2012X135N]
C67  330uF  [CAPMP7343X310N]
C68  1nF  [CAPC0603X33N]
C69  1nF  [CAPC0603X33N]
C70  1nF  [CAPC0603X33N]
C71  1nF  [CAPC0603X33N]
C72  1nF  [CAPC0603X33N]
C73  1nF  [CAPC0603X33N]
C74  1nF  [CAPC0603X33N]
C75  1nF  [CAPC0603X33N]
C76  1nF  [CAPC0603X33N]
C77  1nF  [CAPC0603X33N]
C78  1nF  [CAPC0603X33N]
C79  1nF  [CAPC0603X33N]
C80  1nF  [CAPC0603X33N]
C81  10nF  [CAPC0603X33N]
C82  10nF  [CAPC0603X33N]
C83  10nF  [CAPC0603X33N]
C84  10nF  [CAPC0603X33N]
C85  10nF  [CAPC0603X33N]
C86  10nF  [CAPC0603X33N]
C87  10nF  [CAPC0603X33N]
C88  10nF  [CAPC0603X33N]
C89  10nF  [CAPC0603X33N]
C90  10nF  [CAPC0603X33N]
C91  10nF  [CAPC0603X33N]
C92  10nF  [CAPC0603X33N]
C93  10nF  [CAPC0603X33N]
C94  100nF  [CAPC0603X33N]
C95  100nF  [CAPC0603X33N]
C96  100nF  [CAPC0603X33N]
C97  100nF  [CAPC0603X33N]
C98  100nF  [CAPC0603X33N]
C99  100nF  [CAPC0603X33N]
C100  100nF  [CAPC0603X33N]
C101  100nF  [CAPC0603X33N]
C102  100nF  [CAPC0603X33N]
C103  10uF  [CAPC2012X135N]
C104  10uF  [CAPC2012X135N]
C105  330uF  [CAPMP7343X190N]
C106  330uF  [CAPMP7343X190N]
C107  330uF  [CAPMP7343X190N]
C108  470nF  [CAPC0603X33N]
C109  470nF  [CAPC0603X33N]
C110  470nF  [CAPC0603X33N]
C111  470nF  [CAPC0603X33N]
C112  470nF  [CAPC0603X33N]
C113  470nF  [CAPC0603X33N]
C114  470nF  [CAPC0603X33N]
C115  470nF  [CAPC0603X33N]
L10  120R@100MHz  [INDC1005X55N]
U1  GR740_CLGA625  [BGA625C100P25X25_3182X3182X1543]  (parts B,H,I,J of 10)

### Nets
GND: C14.2 C15.2 C16.1 C17.2 C18.2 C19.1 C20.2 C21.2 C22.1 C23.2 C24.2 C25.1 C26.2 C27.1 C28.2 C29.1 C30.1 C31.1 C32.1 C33.1 C34.1 C35.1 C36.1 C37.1 C38.2 C39.2 C40.2 C41#1.2 C42.1 C43.1 C44.1 C45.1 C46.1 C47.1 C48.2 C49.1 C50.1 C51.1 C52.1 C53.1 C54.1 C55.1 C56.1 C57.2 C58.2 C59.2 C60.2 C61.1 C62.1 C63.1 C64.1 C65.1 C66.1 C67.2 C68.1 C69.1 C70.1 C71.1 C72.1 C73.1 C74.1 C75.1 C76.1 C77.1 C78.1 C79.1 C80.1 C81.1 C82.1 C83.1 C84.1 C85.1 C86.1 C87.1 C88.1 C89.1 C90.1 C91.1 C92.1 C93.1 C94.2 C95.2 C96.2 C97.2 C98.2 C99.2 C100.2 C101.2 C102.2 C103.1 C104.1 C105.2 C106.2 C107.2 C108.1 C109.1 C110.1 C111.1 C112.1 C113.1 C114.1 C115.1 U1.A1(GND) U1.A2(GND) U1.A24(GND) U1.A25(GND) U1.AC9(VSS3V3) U1.AC13(VSS3V3) U1.AD1(GND) U1.AD2(GND) U1.AD25(GND) U1.AE1(GND) U1.AE2(GND) U1.AE24(GND) U1.AE25(GND) U1.B1(GND) U1.B25(GND) U1.C21(VSS2V5) U1.C22(VSS2V5) U1.C23(VSS2V5) U1.C24(VSS2V5) U1.C25(VSS2V5) U1.D9(VSS3V3) U1.D11(VSS3V3) U1.D13(VSS3V3) U1.D21(VSS2V5) U1.E10(VSS3V3) U1.E12(AGNDPLL1V2_SYSPLL) U1.E13(AGNDPLL1V2_MEMPLL) U1.E14(AGNDPLL1V2_SPWPLL) U1.E21(VSS2V5) U1.F3(VSS3V3) U1.F7(VSS3V3) U1.F9(VSS3V3) U1.F11(VSS3V3) U1.F15(VSS3V3) U1.F17(VSS3V3) U1.F19(VSS3V3) U1.F21(VSS2V5) U1.G6(VSS3V3) U1.G8(VSS3V3) U1.G10(VSS3V3) U1.G16(VSS3V3) U1.G18(VSS3V3) U1.G20(VSS3V3) U1.G21(VSS2V5) U1.H3(VSS3V3) U1.H7(VSS3V3) U1.H9(GND) U1.H11(GND) U1.H13(GND) U1.H15(GND) U1.H17(GND) U1.H19(VSS3V3) U1.H21(VSS2V5) U1.J6(VSS3V3) U1.J8(GND) U1.J10(GND) U1.J12(GND) U1.J14(GND) U1.J16(GND) U1.J18(GND) U1.J20(VSS3V3) U1.K3(VSS3V3) U1.K7(VSS3V3) U1.K9(GND) U1.K11(GND) U1.K13(GND) U1.K15(GND) U1.K17(GND) U1.K19(VSS3V3) U1.K21(VSS2V5) U1.L6(VSS3V3) U1.L8(GND) U1.L10(GND) U1.L12(GND) U1.L14(GND) U1.L16(GND) U1.L18(GND) U1.L20(VSS3V3) U1.M7(VSS3V3) U1.M9(GND) U1.M11(GND) U1.M13(GND) U1.M15(GND) U1.M17(GND) U1.M19(VSS3V3) U1.M21(VSS2V5) U1.N3(VSS3V3) U1.N6(VSS3V3) U1.N8(GND) U1.N10(GND) U1.N12(GND) U1.N14(GND) U1.N16(GND) U1.N18(GND) U1.N20(VSS3V3) U1.P7(VSS3V3) U1.P9(GND) U1.P11(GND) U1.P13(GND) U1.P15(GND) U1.P17(GND) U1.P19(VSS3V3) U1.P21(VSS2V5) U1.R3(VSS3V3) U1.R6(VSS3V3) U1.R8(GND) U1.R10(GND) U1.R12(GND) U1.R14(GND) U1.R16(GND) U1.R18(GND) U1.R20(VSS3V3) U1.T7(VSS3V3) U1.T9(GND) U1.T11(GND) U1.T13(GND) U1.T15(GND) U1.T17(GND) U1.T19(VSS3V3) U1.T21(VSS2V5) U1.U6(VSS3V3) U1.U8(GND) U1.U10(GND) U1.U12(GND) U1.U14(GND) U1.U16(GND) U1.U18(GND) U1.U20(VSS3V3) U1.V3(VSS3V3) U1.V7(VSS3V3) U1.V9(GND) U1.V11(GND) U1.V13(GND) U1.V15(GND) U1.V17(GND) U1.V19(VSS3V3) U1.V21(VSS2V5) U1.W6(VSS3V3) U1.W8(VSS3V3) U1.W10(VSS3V3) U1.W12(VSS3V3) U1.W14(VSS3V3) U1.W16(VSS3V3) U1.W18(VSS3V3) U1.W20(VSS3V3) U1.W21(VSS2V5) U1.Y3(VSS3V3) U1.Y7(VSS3V3) U1.Y9(VSS3V3) U1.Y11(VSS3V3) U1.Y13(VSS3V3) U1.Y15(VSS3V3) U1.Y17(VSS3V3) U1.Y19(VSS3V3) U1.Y21(VSS2V5) U1.Y22(VSS2V5) U1.Y23(VSS2V5) U1.Y24(VSS2V5) U1.Y25(VSS2V5)
P1V2: C23.1 C24.1 C25.2 C26.1 C27.2 C28.1 C29.2 C68.2 C69.2 C70.2 C71.2 C72.2 C73.2 C74.2 C75.2 C76.2 C77.2 C78.2 C79.2 C80.2 C81.2 C82.2 C83.2 C84.2 C85.2 C86.2 C87.2 C88.2 C89.2 C90.2 C91.2 C92.2 C93.2 C94.1 C95.1 C96.1 C97.1 C98.1 C99.1 C100.1 C101.1 C102.1 C103.2 C104.2 C105.1 C106.1 C107.1 C108.2 C109.2 C110.2 C111.2 C112.2 C113.2 C114.2 C115.2 L10.1 U1.G12(DVDDPLL1V2_SYSPLL) U1.G13(DVDDPLL1V2_MEMPLL) U1.G14(DVDDPLL1V2_SPWPLL) U1.H8(VDD1V2) U1.H10(VDD1V2) U1.H12(VDD1V2) U1.H14(VDD1V2) U1.H16(VDD1V2) U1.H18(VDD1V2) U1.J9(VDD1V2) U1.J11(VDD1V2) U1.J13(VDD1V2) U1.J15(VDD1V2) U1.J17(VDD1V2) U1.K8(VDD1V2) U1.K10(VDD1V2) U1.K12(VDD1V2) U1.K14(VDD1V2) U1.K16(VDD1V2) U1.K18(VDD1V2) U1.L9(VDD1V2) U1.L11(VDD1V2) U1.L13(VDD1V2) U1.L15(VDD1V2) U1.L17(VDD1V2) U1.M8(VDD1V2) U1.M10(VDD1V2) U1.M12(VDD1V2) U1.M14(VDD1V2) U1.M16(VDD1V2) U1.M18(VDD1V2) U1.N9(VDD1V2) U1.N11(VDD1V2) U1.N13(VDD1V2) U1.N15(VDD1V2) U1.N17(VDD1V2) U1.P8(VDD1V2) U1.P10(VDD1V2) U1.P12(VDD1V2) U1.P14(VDD1V2) U1.P16(VDD1V2) U1.P18(VDD1V2) U1.R9(VDD1V2) U1.R11(VDD1V2) U1.R13(VDD1V2) U1.R15(VDD1V2) U1.R17(VDD1V2) U1.T8(VDD1V2) U1.T10(VDD1V2) U1.T12(VDD1V2) U1.T14(VDD1V2) U1.T16(VDD1V2) U1.T18(VDD1V2) U1.U9(VDD1V2) U1.U11(VDD1V2) U1.U13(VDD1V2) U1.U15(VDD1V2) U1.U17(VDD1V2) U1.V8(VDD1V2) U1.V10(VDD1V2) U1.V12(VDD1V2) U1.V14(VDD1V2) U1.V16(VDD1V2) U1.V18(VDD1V2)
P1V2_PLL: C14.1 C15.1 C16.2 C17.1 C18.1 C19.2 C20.1 C21.1 C22.2 L10.2 U1.F12(AVDDPLL1V2_SYSPLL) U1.F13(AVDDPLL1V2_MEMPLL) U1.F14(AVDDPLL1V2_SPWPLL)
P2V5: C49.2 C50.2 C51.2 C52.2 C53.2 C54.2 C55.2 C56.2 C57.1 C58.1 C59.1 C60.1 C61.2 C62.2 C63.2 C64.2 C65.2 C66.2 C67.1 U1.J21(VDIG2V5) U1.L21(VDIG2V5) U1.N21(VDIG2V5) U1.R21(VDIG2V5) U1.U21(VDIG2V5)
P3V3: C30.2 C31.2 C32.2 C33.2 C34.2 C35.2 C36.2 C37.2 C38.1 C39.1 C40.1 C41#1.1 C42.2 C43.2 C44.2 C45.2 C46.2 C47.2 C48.1 U1.AC8(VDIG3V3) U1.AC12(VDIG3V3) U1.D10(VDIG3V3) U1.D12(VDIG3V3) U1.E3(VDIG3V3) U1.E9(VDIG3V3) U1.E11(VDIG3V3) U1.F6(VDIG3V3) U1.F8(VDIG3V3) U1.F10(VDIG3V3) U1.F16(VDIG3V3) U1.F18(VDIG3V3) U1.G3(VDIG3V3) U1.G7(VDIG3V3) U1.G9(VDIG3V3) U1.G11(VDIG3V3) U1.G15(VDIG3V3) U1.G17(VDIG3V3) U1.G19(VDIG3V3) U1.H6(VDIG3V3) U1.H20(VDIG3V3) U1.J3(VDIG3V3) U1.J7(VDIG3V3) U1.J19(VDIG3V3) U1.K6(VDIG3V3) U1.K20(VDIG3V3) U1.L3(VDIG3V3) U1.L7(VDIG3V3) U1.L19(VDIG3V3) U1.M6(VDIG3V3) U1.M20(VDIG3V3) U1.N7(VDIG3V3) U1.N19(VDIG3V3) U1.P3(VDIG3V3) U1.P6(VDIG3V3) U1.P20(VDIG3V3) U1.R7(VDIG3V3) U1.R19(VDIG3V3) U1.T6(VDIG3V3) U1.T20(VDIG3V3) U1.U3(VDIG3V3) U1.U7(VDIG3V3) U1.U19(VDIG3V3) U1.V6(VDIG3V3) U1.V20(VDIG3V3) U1.W3(VDIG3V3) U1.W7(VDIG3V3) U1.W9(VDIG3V3) U1.W11(VDIG3V3) U1.W13(VDIG3V3) U1.W15(VDIG3V3) U1.W17(VDIG3V3) U1.W19(VDIG3V3) U1.Y6(VDIG3V3) U1.Y8(VDIG3V3) U1.Y10(VDIG3V3) U1.Y12(VDIG3V3) U1.Y14(VDIG3V3) U1.Y16(VDIG3V3) U1.Y18(VDIG3V3)  [project net 3.3V]

Not connected (* = marked no-connect by the designer): U1 AC14(RESV)

### Notes on the sheet
- (in symbol CTE3528-21_100UF_6.3V_10%) +
- (in symbol CTE7343-19_330UF_2.5V_20%_LESR0025_KEMET_T520) +
- (in symbol CTE7343-31_330UF_6.3V_20%_LESR0025_KEMET_T520) +
- (in symbol GR740_CLGA625, part B) PIN OUT: 240315_rev1-4
- (in symbol GR740_CLGA625, part H) PIN OUT: 240315_rev1-4
- (in symbol GR740_CLGA625, part I) PIN OUT: 240315_rev1-4
- (in symbol GR740_CLGA625, part J) PIN OUT: 240315_rev1-4

### Library data of the parts
C14 C17 C20 C23 = CTE3528-21_100UF_6.3V_10%: Polarised capacitor; Part Description: Solid Tantalum Chip Capacitor; Manufacturer: GENERIC; Manufacturer1 Part Number: TAJB107K006R; Voltage: 6.3V; Tolerance: ±10%; Part Number: CTE3528-21_100UF_6.3V_10%; Component Kind: Standard; Component Type: Standard; Pin Count: 2; Value: 100uF; Status: Preferred; Manufacturer Part Number: CTE3528-21_100UF_6.3V_10%; Case: B; Mounted: Yes; Socket: No; SMD: Yes; Sense: No; HelpURL: \\cern.ch\dfs\Applications\Altium\Datasheets\CTE_AVX_TAJ.pdf; Author: CERN DEM JLC; CreateDate: 03.12.2007; LatestRevisionDate: 03.12.2007; Manufacturer1 Example: AVX; Manufacturer1 ComponentHeight: 2.1mm
C15 C18 C21 C24 C26 C28 C38-C40 C41#1 C57-C60 C94-C102 = CC0201_100NF_6.3V_10%_X5R: Non-polarised capacitor; Manufacturer: GENERIC; Part Description: SMD Multilayer Chip Ceramic Capacitor; Manufacturer1 Part Number: 02016D104KAT2A; Voltage: 6.3V; TC: X5R; Tolerance: ±10%; Part Number: CC0201_100NF_6.3V_10%_X5R; Component Kind: Standard; Component Type: Standard; Pin Count: 2; Value: 100nF; Status: Not Recommended; Manufacturer Part Number: CC0201_100NF_6.3V_10%_X5R; Case: 0201; Mounted: Yes; Socket: No; SMD: Yes; Sense: No; Manufacturer1 Example: AVX; Manufacturer1 ComponentHeight: 0.33mm; HelpURL: \\cern.ch\dfs\Applications\Altium\Datasheets\CC0201_X5R_AVX.pdf; Author: CERN DEM JLC; CreateDate: 03/12/2007; LatestRevisionDate: 03/12/2007
C16 C19 C22 C25 C27 C29-C33 C49-C52 C68-C80 = CC0201_1NF_16V_10%_X5R: Non-polarised capacitor; Part Description: SMD Multilayer Chip Ceramic Capacitor; Manufacturer: GENERIC; Manufacturer1 Part Number: 0201YD102KAT2A; Voltage: 16V; TC: X5R; Tolerance: ±10%; Part Number: CC0201_1NF_16V_10%_X5R; Component Kind: Standard; Component Type: Standard; Pin Count: 2; Value: 1nF; Status: Not Recommended; Manufacturer Part Number: CC0201_1NF_16V_10%_X5R; Case: 0201; Mounted: Yes; Socket: No; SMD: Yes; Sense: No; Manufacturer1 Example: AVX; Manufacturer1 ComponentHeight: 0.33mm; HelpURL: \\cern.ch\dfs\Applications\Altium\Datasheets\CC0201_X5R_AVX.pdf; Author: CERN DEM JLC; CreateDate: 03.12.2007; LatestRevisionDate: 03.12.2007
C34-C37 C53-C56 C81-C93 = CC0201_10NF_10V_10%_X5R: Non-polarised capacitor; Part Description: SMD Multilayer Chip Ceramic Capacitor; Manufacturer: GENERIC; Manufacturer1 Part Number: 0201ZD103KAT2A; Voltage: 10V; TC: X5R; Tolerance: ±10%; Part Number: CC0201_10NF_10V_10%_X5R; Component Kind: Standard; Component Type: Standard; Pin Count: 2; Value: 10nF; Status: Not Recommended; Manufacturer Part Number: CC0201_10NF_10V_10%_X5R; Case: 0201; Mounted: Yes; Socket: No; SMD: Yes; Sense: No; Manufacturer1 Example: AVX; Manufacturer1 ComponentHeight: 0.33mm; HelpURL: \\cern.ch\dfs\Applications\Altium\Datasheets\CC0201_X5R_AVX.pdf; Author: CERN DEM JLC; CreateDate: 03.12.2007; LatestRevisionDate: 03.12.2007
C42-C45 C61-C64 C108-C115 = CC0201_470NF_4V_20%_X5R: Non-polarised capacitor; Part Description: SMD Multilayer Chip Ceramic Capacitor; Manufacturer: GENERIC; Manufacturer1 Part Number: AMK063BJ474MP-F; Voltage: 4V; TC: X5R; Tolerance: ±20%; Part Number: CC0201_470NF_4V_20%_X5R; Component Kind: Standard; Component Type: Standard; Pin Count: 2; Value: 470nF; Status: Not Recommended; Manufacturer Part Number: CC0201_470NF_4V_20%_X5R; Case: 0201; Mounted: Yes; Socket: No; SMD: Yes; Sense: No; Manufacturer1 Example: TAIYO YUDEN; Manufacturer1 ComponentHeight: 0.33mm; HelpURL: \\cern.ch\dfs\Applications\Altium\Datasheets\CC0201_X5R_TAIYO-YUDEN_STANDARD-CLASS2.pdf; Author: CERN DEM JLC; CreateDate: 27.05.2010; LatestRevisionDate: 27.05.2010
C46 C47 C65 C66 C103 C104 = CC0805_10UF_16V_10%_X5R: Non-polarised capacitor; Part Description: SMD Multilayer Chip Ceramic Capacitor; Manufacturer: GENERIC; Manufacturer1 Part Number: C0805C106K4PAC; Voltage: 16V; TC: X5R; Tolerance: ±10%; Part Number: CC0805_10UF_16V_10%_X5R; Component Kind: Standard; Component Type: Standard; Pin Count: 2; Value: 10uF; Status: Preferred; Manufacturer Part Number: CC0805_10UF_16V_10%_X5R; Case: 0805; Mounted: Yes; Socket: No; SMD: Yes; Sense: No; Manufacturer1 Example: KEMET; Manufacturer1 ComponentHeight: 1.4mm; HelpURL: \\cern.ch\dfs\Applications\Altium\Datasheets\CC1206_X5R_KEMET.pdf; Author: CERN DEM JLC; CreateDate: 03.12.2007; LatestRevisionDate: 03.12.2007
C48 C67 = CTE7343-31_330UF_6.3V_20%_LESR0025_KEMET_T520: Polarised capacitor; Manufacturer: KEMET; Part Description: Low ESR 0R025 Tantalum Chip Capacitor; Manufacturer Part Number: T520D337M006ATE025; Voltage: 6.3V; Tolerance: ±20%; Part Number: CTE7343-31_330UF_6.3V_20%_LESR0025_KEMET_T520; Component Kind: Standard; Component Type: Standard; Pin Count: 2; Value: 330uF; Status: None; Case: D; Mounted: Yes; Socket: No; SMD: Yes; Sense: No; ComponentHeight: 3.1mm; HelpURL: \\cern.ch\dfs\Applications\Altium\Datasheets\CTE-LESR_KEMET_T520.pdf; Author: CERN DEM JLC; CreateDate: 20/10/2010; LatestRevisionDate: 20/10/2010
C105-C107 = CTE7343-19_330UF_2.5V_20%_LESR0025_KEMET_T520: Polarised capacitor; Manufacturer: KEMET; Part Description: Low ESR 0R025 Tantalum Chip Capacitor; Manufacturer Part Number: T520V337M2R5ATE025; Voltage: 2.5V; Tolerance: ±20%; Part Number: CTE7343-19_330UF_2.5V_20%_LESR0025_KEMET_T520; Component Kind: Standard; Component Type: Standard; Pin Count: 2; Value: 330uF; Status: None; Case: V; Mounted: Yes; Socket: No; SMD: Yes; Sense: No; ComponentHeight: 1.9mm; HelpURL: \\cern.ch\dfs\Applications\Altium\Datasheets\CTE-LESR_KEMET_T520.pdf; Author: CERN DEM MR; CreateDate: 23.03.2016; LatestRevisionDate: 23.03.2016
L10 = IND0402_MURATA_BLM15PX121SN1D: Part Description: SMD EMIFIL Chip Ferrite Bead; Manufacturer: MURATA; Power: 2A; Resistance: 0.055R; Tolerance: ±25%; Part Number: IND0402_MURATA_BLM15PX121SN1D; Component Kind: Standard; Component Type: Standard; Pin Count: 2; Value: 120R@100MHz; Status: None; Manufacturer Part Number: BLM15PX121SN1D; Case: 0402; Mounted: Yes; Socket: No; SMD: Yes; Sense: No; ComponentHeight: 0.55mm; HelpURL: \\cern.ch\dfs\Applications\Altium\Datasheets\IND0402_MURATA_BLM15PX.pdf; Author: CERN DEM JMW; CreateDate: 19.02.2014; LatestRevisionDate: 25.10.2018
U1 = GR740_CLGA625: Category: IC; Technology: SMD

## Sheet GR740_SpW.SchDoc
size A3
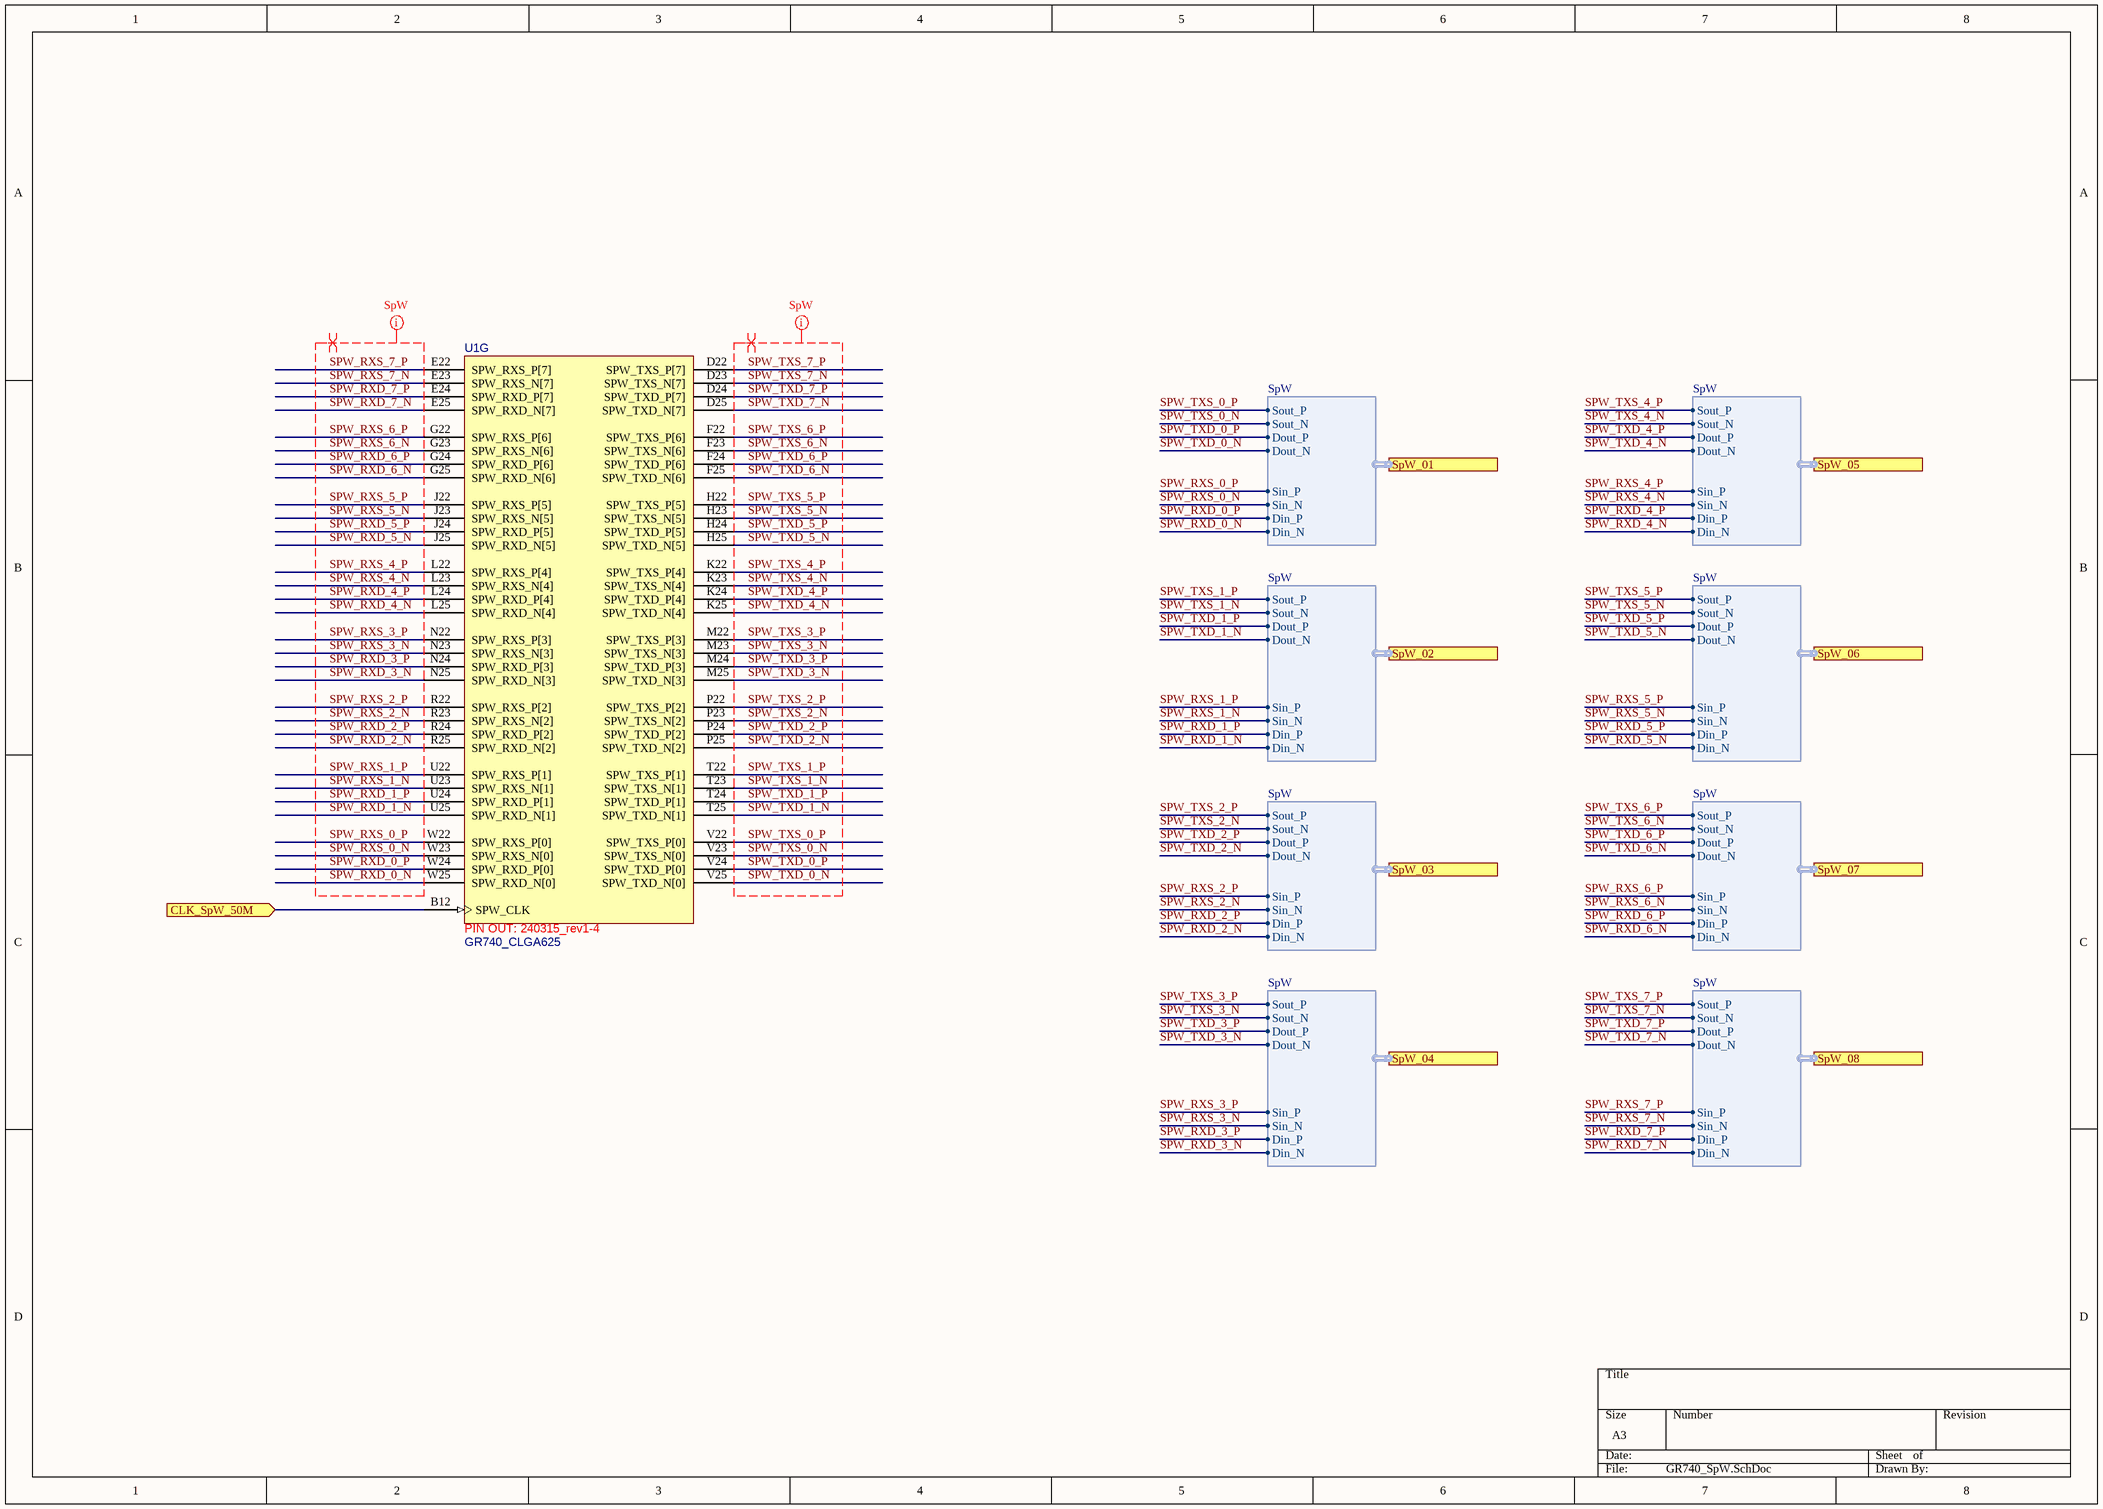
[diagram p10: GR740_SpW.SchDoc]

### Parts
U1  GR740_CLGA625  [BGA625C100P25X25_3182X3182X1543]  (part G of 10)

### Ports
CLK_SpW_50M (in), SpW_01 (harness SpW), SpW_02 (harness SpW), SpW_03 (harness SpW), SpW_04 (harness SpW), SpW_05 (harness SpW), SpW_06 (harness SpW), SpW_07 (harness SpW), SpW_08 (harness SpW)

### Harnesses
SpW: Sout_P, Sout_N, Dout_P, Dout_N, Sin_P, Sin_N, Din_P, Din_N

### Nets
CLK_SpW_50M: U1.B12(SPW_CLK) ; port CLK_SpW_50M
SPW_RXD_0_N: U1.W25(SPW_RXD_N[0]) ; port SpW_01.Din_N  [project net CPtp08-DC_N]
SPW_RXD_0_P: U1.W24(SPW_RXD_P[0]) ; port SpW_01.Din_P  [project net CPtp08-DC_P]
SPW_RXD_1_N: U1.U25(SPW_RXD_N[1]) ; port SpW_02.Din_N  [project net CPtp01-DC_N]
SPW_RXD_1_P: U1.U24(SPW_RXD_P[1]) ; port SpW_02.Din_P  [project net CPtp01-DC_P]
SPW_RXD_2_N: U1.R25(SPW_RXD_N[2]) ; port SpW_03.Din_N  [project net CPtp02-DC_N]
SPW_RXD_2_P: U1.R24(SPW_RXD_P[2]) ; port SpW_03.Din_P  [project net CPtp02-DC_P]
SPW_RXD_3_N: U1.N25(SPW_RXD_N[3]) ; port SpW_04.Din_N  [project net CPtp03-DC_N]
SPW_RXD_3_P: U1.N24(SPW_RXD_P[3]) ; port SpW_04.Din_P  [project net CPtp03-DC_P]
SPW_RXD_4_N: U1.L25(SPW_RXD_N[4]) ; port SpW_05.Din_N  [project net CPtp04-DC_N]
SPW_RXD_4_P: U1.L24(SPW_RXD_P[4]) ; port SpW_05.Din_P  [project net CPtp04-DC_P]
SPW_RXD_5_N: U1.J25(SPW_RXD_N[5]) ; port SpW_06.Din_N  [project net CPtp05-DC_N]
SPW_RXD_5_P: U1.J24(SPW_RXD_P[5]) ; port SpW_06.Din_P  [project net CPtp05-DC_P]
SPW_RXD_6_N: U1.G25(SPW_RXD_N[6]) ; port SpW_07.Din_N  [project net CPtp06-DC_N]
SPW_RXD_6_P: U1.G24(SPW_RXD_P[6]) ; port SpW_07.Din_P  [project net CPtp06-DC_P]
SPW_RXD_7_N: U1.E25(SPW_RXD_N[7]) ; port SpW_08.Din_N  [project net CPtp07-DC_N]
SPW_RXD_7_P: U1.E24(SPW_RXD_P[7]) ; port SpW_08.Din_P  [project net CPtp07-DC_P]
SPW_RXS_0_N: U1.W23(SPW_RXS_N[0]) ; port SpW_01.Sin_N  [project net CPtp08-DA_N]
SPW_RXS_0_P: U1.W22(SPW_RXS_P[0]) ; port SpW_01.Sin_P  [project net CPtp08-DA_P]
SPW_RXS_1_N: U1.U23(SPW_RXS_N[1]) ; port SpW_02.Sin_N  [project net CPtp01-DA_N]
SPW_RXS_1_P: U1.U22(SPW_RXS_P[1]) ; port SpW_02.Sin_P  [project net CPtp01-DA_P]
SPW_RXS_2_N: U1.R23(SPW_RXS_N[2]) ; port SpW_03.Sin_N  [project net CPtp02-DA_N]
SPW_RXS_2_P: U1.R22(SPW_RXS_P[2]) ; port SpW_03.Sin_P  [project net CPtp02-DA_P]
SPW_RXS_3_N: U1.N23(SPW_RXS_N[3]) ; port SpW_04.Sin_N  [project net CPtp03-DA_N]
SPW_RXS_3_P: U1.N22(SPW_RXS_P[3]) ; port SpW_04.Sin_P  [project net CPtp03-DA_P]
SPW_RXS_4_N: U1.L23(SPW_RXS_N[4]) ; port SpW_05.Sin_N  [project net CPtp04-DA_N]
SPW_RXS_4_P: U1.L22(SPW_RXS_P[4]) ; port SpW_05.Sin_P  [project net CPtp04-DA_P]
SPW_RXS_5_N: U1.J23(SPW_RXS_N[5]) ; port SpW_06.Sin_N  [project net CPtp05-DA_N]
SPW_RXS_5_P: U1.J22(SPW_RXS_P[5]) ; port SpW_06.Sin_P  [project net CPtp05-DA_P]
SPW_RXS_6_N: U1.G23(SPW_RXS_N[6]) ; port SpW_07.Sin_N  [project net CPtp06-DA_N]
SPW_RXS_6_P: U1.G22(SPW_RXS_P[6]) ; port SpW_07.Sin_P  [project net CPtp06-DA_P]
SPW_RXS_7_N: U1.E23(SPW_RXS_N[7]) ; port SpW_08.Sin_N  [project net CPtp07-DA_N]
SPW_RXS_7_P: U1.E22(SPW_RXS_P[7]) ; port SpW_08.Sin_P  [project net CPtp07-DA_P]
SPW_TXD_0_N: U1.V25(SPW_TXD_N[0]) ; port SpW_01.Dout_N  [project net CPtp08-DD_N]
SPW_TXD_0_P: U1.V24(SPW_TXD_P[0]) ; port SpW_01.Dout_P  [project net CPtp08-DD_P]
SPW_TXD_1_N: U1.T25(SPW_TXD_N[1]) ; port SpW_02.Dout_N  [project net CPtp01-DD_N]
SPW_TXD_1_P: U1.T24(SPW_TXD_P[1]) ; port SpW_02.Dout_P  [project net CPtp01-DD_P]
SPW_TXD_2_N: U1.P25(SPW_TXD_N[2]) ; port SpW_03.Dout_N  [project net CPtp02-DD_N]
SPW_TXD_2_P: U1.P24(SPW_TXD_P[2]) ; port SpW_03.Dout_P  [project net CPtp02-DD_P]
SPW_TXD_3_N: U1.M25(SPW_TXD_N[3]) ; port SpW_04.Dout_N  [project net CPtp03-DD_N]
SPW_TXD_3_P: U1.M24(SPW_TXD_P[3]) ; port SpW_04.Dout_P  [project net CPtp03-DD_P]
SPW_TXD_4_N: U1.K25(SPW_TXD_N[4]) ; port SpW_05.Dout_N  [project net CPtp04-DD_N]
SPW_TXD_4_P: U1.K24(SPW_TXD_P[4]) ; port SpW_05.Dout_P  [project net CPtp04-DD_P]
SPW_TXD_5_N: U1.H25(SPW_TXD_N[5]) ; port SpW_06.Dout_N  [project net CPtp05-DD_N]
SPW_TXD_5_P: U1.H24(SPW_TXD_P[5]) ; port SpW_06.Dout_P  [project net CPtp05-DD_P]
SPW_TXD_6_N: U1.F25(SPW_TXD_N[6]) ; port SpW_07.Dout_N  [project net CPtp06-DD_N]
SPW_TXD_6_P: U1.F24(SPW_TXD_P[6]) ; port SpW_07.Dout_P  [project net CPtp06-DD_P]
SPW_TXD_7_N: U1.D25(SPW_TXD_N[7]) ; port SpW_08.Dout_N  [project net CPtp07-DD_N]
SPW_TXD_7_P: U1.D24(SPW_TXD_P[7]) ; port SpW_08.Dout_P  [project net CPtp07-DD_P]
SPW_TXS_0_N: U1.V23(SPW_TXS_N[0]) ; port SpW_01.Sout_N  [project net CPtp08-DB_N]
SPW_TXS_0_P: U1.V22(SPW_TXS_P[0]) ; port SpW_01.Sout_P  [project net CPtp08-DB_P]
SPW_TXS_1_N: U1.T23(SPW_TXS_N[1]) ; port SpW_02.Sout_N  [project net CPtp01-DB_N]
SPW_TXS_1_P: U1.T22(SPW_TXS_P[1]) ; port SpW_02.Sout_P  [project net CPtp01-DB_P]
SPW_TXS_2_N: U1.P23(SPW_TXS_N[2]) ; port SpW_03.Sout_N  [project net CPtp02-DB_N]
SPW_TXS_2_P: U1.P22(SPW_TXS_P[2]) ; port SpW_03.Sout_P  [project net CPtp02-DB_P]
SPW_TXS_3_N: U1.M23(SPW_TXS_N[3]) ; port SpW_04.Sout_N  [project net CPtp03-DB_N]
SPW_TXS_3_P: U1.M22(SPW_TXS_P[3]) ; port SpW_04.Sout_P  [project net CPtp03-DB_P]
SPW_TXS_4_N: U1.K23(SPW_TXS_N[4]) ; port SpW_05.Sout_N  [project net CPtp04-DB_N]
SPW_TXS_4_P: U1.K22(SPW_TXS_P[4]) ; port SpW_05.Sout_P  [project net CPtp04-DB_P]
SPW_TXS_5_N: U1.H23(SPW_TXS_N[5]) ; port SpW_06.Sout_N  [project net CPtp05-DB_N]
SPW_TXS_5_P: U1.H22(SPW_TXS_P[5]) ; port SpW_06.Sout_P  [project net CPtp05-DB_P]
SPW_TXS_6_N: U1.F23(SPW_TXS_N[6]) ; port SpW_07.Sout_N  [project net CPtp06-DB_N]
SPW_TXS_6_P: U1.F22(SPW_TXS_P[6]) ; port SpW_07.Sout_P  [project net CPtp06-DB_P]
SPW_TXS_7_N: U1.D23(SPW_TXS_N[7]) ; port SpW_08.Sout_N  [project net CPtp07-DB_N]
SPW_TXS_7_P: U1.D22(SPW_TXS_P[7]) ; port SpW_08.Sout_P  [project net CPtp07-DB_P]

### Layout directives
differential pair: SPW_RXD_0_N, SPW_RXD_0_P, SPW_RXD_1_N, SPW_RXD_1_P, SPW_RXD_2_N, SPW_RXD_2_P, SPW_RXD_3_N, SPW_RXD_3_P, SPW_RXD_4_N, SPW_RXD_4_P, SPW_RXD_5_N, SPW_RXD_5_P, SPW_RXD_6_N, SPW_RXD_6_P, SPW_RXD_7_N, SPW_RXD_7_P, SPW_RXS_0_N, SPW_RXS_0_P, SPW_RXS_1_N, SPW_RXS_1_P, SPW_RXS_2_N, SPW_RXS_2_P, SPW_RXS_3_N, SPW_RXS_3_P, SPW_RXS_4_N, SPW_RXS_4_P, SPW_RXS_5_N, SPW_RXS_5_P, SPW_RXS_6_N, SPW_RXS_6_P, SPW_RXS_7_N, SPW_RXS_7_P, SPW_TXD_0_N, SPW_TXD_0_P, SPW_TXD_1_N, SPW_TXD_1_P, SPW_TXD_2_N, SPW_TXD_2_P, SPW_TXD_3_N, SPW_TXD_3_P, SPW_TXD_4_N, SPW_TXD_4_P, SPW_TXD_5_N, SPW_TXD_5_P, SPW_TXD_6_N, SPW_TXD_6_P, SPW_TXD_7_N, SPW_TXD_7_P, SPW_TXS_0_N, SPW_TXS_0_P, SPW_TXS_1_N, SPW_TXS_1_P, SPW_TXS_2_N, SPW_TXS_2_P, SPW_TXS_3_N, SPW_TXS_3_P, SPW_TXS_4_N, SPW_TXS_4_P, SPW_TXS_5_N, SPW_TXS_5_P, SPW_TXS_6_N, SPW_TXS_6_P, SPW_TXS_7_N, SPW_TXS_7_P
net class SpW: SPW_RXD_0_N, SPW_RXD_0_P, SPW_RXD_1_N, SPW_RXD_1_P, SPW_RXD_2_N, SPW_RXD_2_P, SPW_RXD_3_N, SPW_RXD_3_P, SPW_RXD_4_N, SPW_RXD_4_P, SPW_RXD_5_N, SPW_RXD_5_P, SPW_RXD_6_N, SPW_RXD_6_P, SPW_RXD_7_N, SPW_RXD_7_P, SPW_RXS_0_N, SPW_RXS_0_P, SPW_RXS_1_N, SPW_RXS_1_P, SPW_RXS_2_N, SPW_RXS_2_P, SPW_RXS_3_N, SPW_RXS_3_P, SPW_RXS_4_N, SPW_RXS_4_P, SPW_RXS_5_N, SPW_RXS_5_P, SPW_RXS_6_N, SPW_RXS_6_P, SPW_RXS_7_N, SPW_RXS_7_P, SPW_TXD_0_N, SPW_TXD_0_P, SPW_TXD_1_N, SPW_TXD_1_P, SPW_TXD_2_N, SPW_TXD_2_P, SPW_TXD_3_N, SPW_TXD_3_P, SPW_TXD_4_N, SPW_TXD_4_P, SPW_TXD_5_N, SPW_TXD_5_P, SPW_TXD_6_N, SPW_TXD_6_P, SPW_TXD_7_N, SPW_TXD_7_P, SPW_TXS_0_N, SPW_TXS_0_P, SPW_TXS_1_N, SPW_TXS_1_P, SPW_TXS_2_N, SPW_TXS_2_P, SPW_TXS_3_N, SPW_TXS_3_P, SPW_TXS_4_N, SPW_TXS_4_P, SPW_TXS_5_N, SPW_TXS_5_P, SPW_TXS_6_N, SPW_TXS_6_P, SPW_TXS_7_N, SPW_TXS_7_P

### Notes on the sheet
- (in symbol GR740_CLGA625, part G) PIN OUT: 240315_rev1-4

### Library data of the parts
U1 = GR740_CLGA625: Category: IC; Technology: SMD